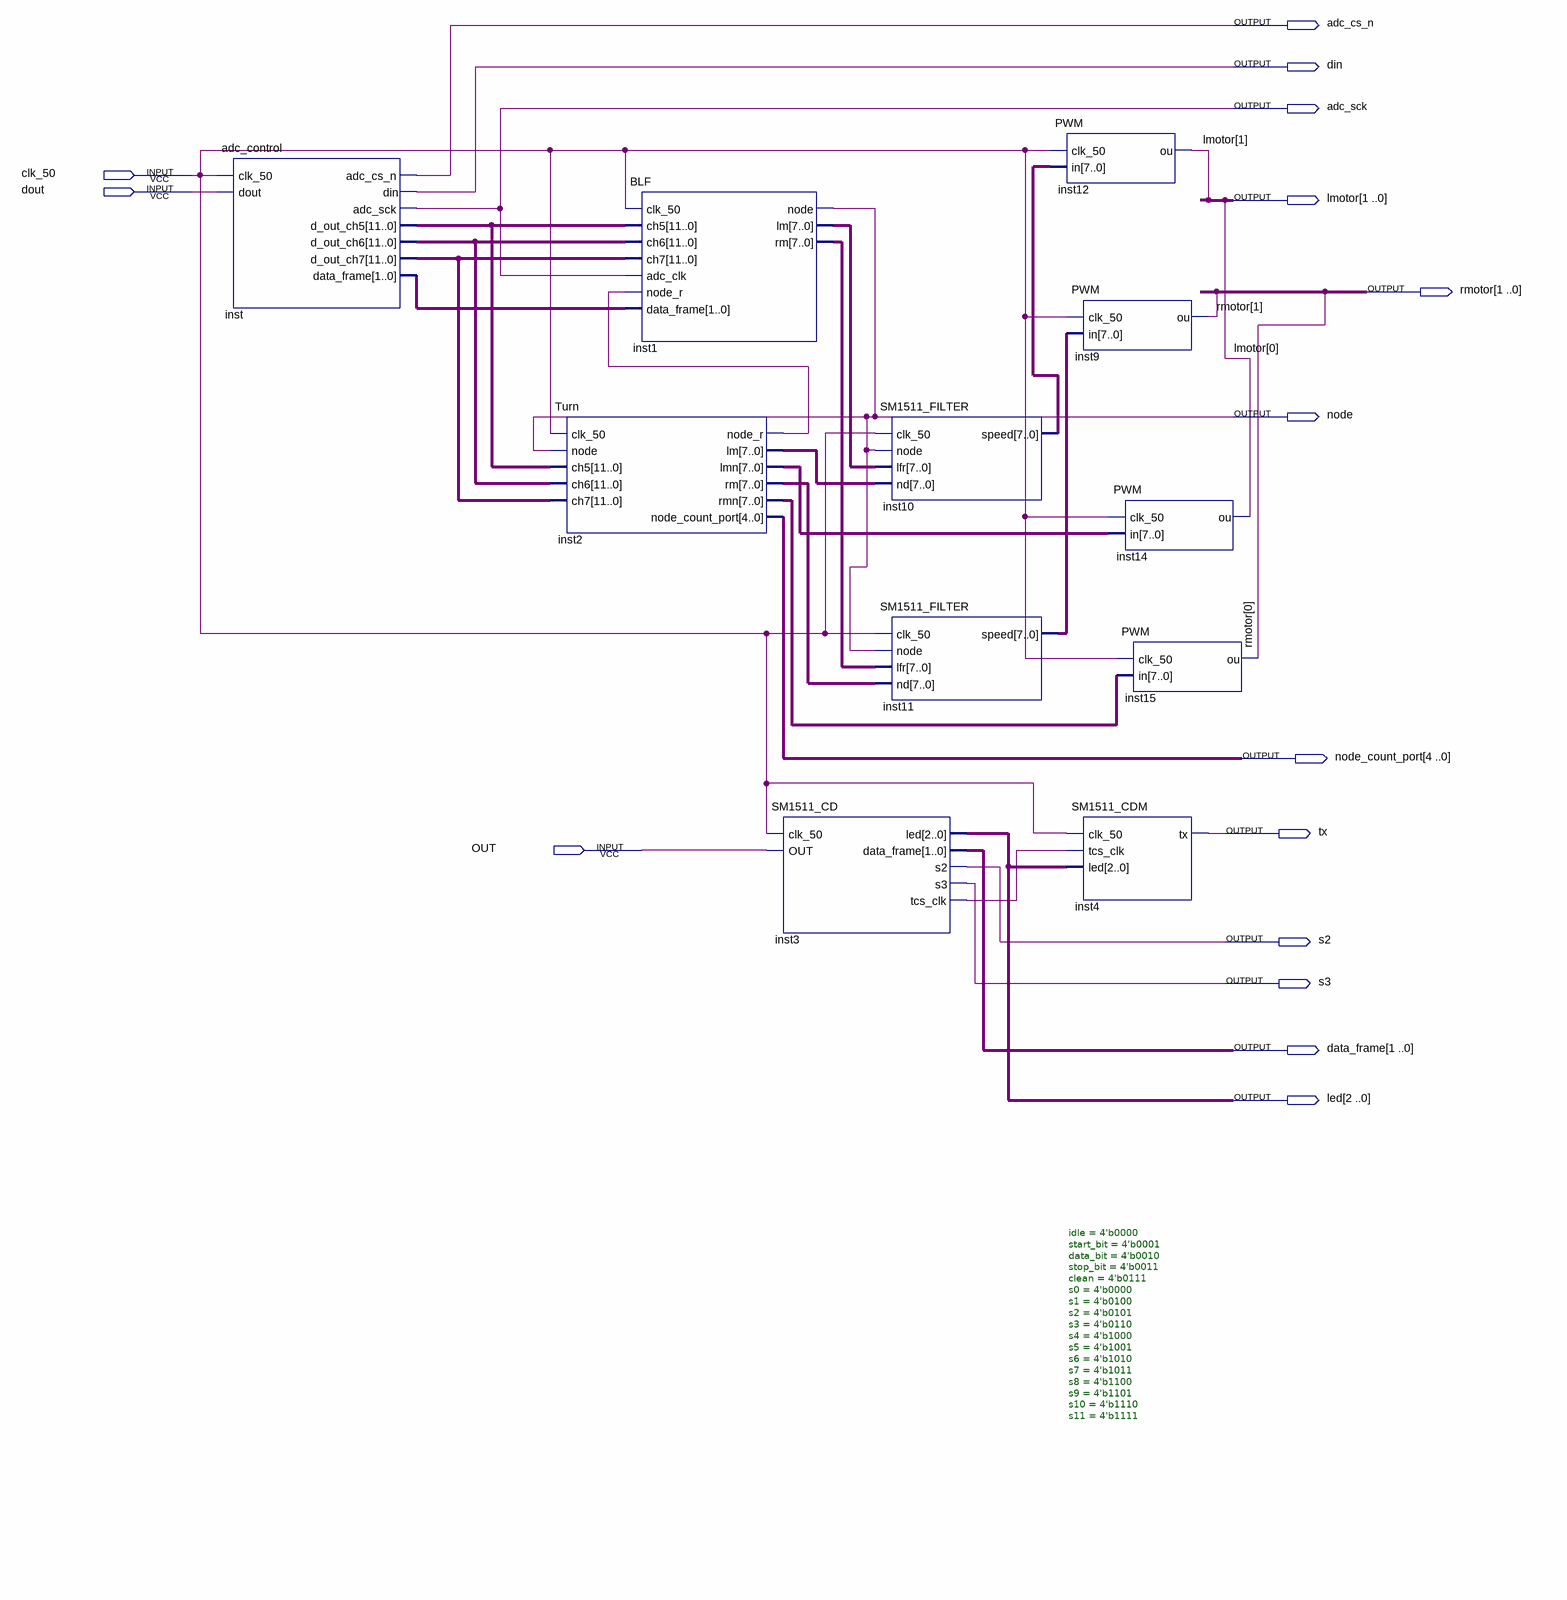
[diagram p0: schematic sheet]
// Quartus schematic BD.bdf as structural Verilog: 11 symbols, 15 pins
module BD (
  input  clk_50,
  input  dout,
  input  OUT,
  output adc_cs_n,
  output din,
  output adc_sck,
  output [1:0] lmotor,
  output [1:0] rmotor,
  output node,
  output [4:0] node_count_port,
  output tx,
  output s2,
  output s3,
  output [1:0] data_frame,
  output [2:0] led
);

  wire inst2_node_r, inst3_tcs_clk;
  wire [1:0] inst_data_frame;
  wire [7:0] inst1_lm, inst1_rm, inst2_lm, inst2_lmn, inst2_rm, inst2_rmn, inst10_speed, inst11_speed;
  wire [11:0] inst_d_out_ch5, inst_d_out_ch6, inst_d_out_ch7;

  adc_control inst (
    .clk_50(clk_50), .dout(dout), .adc_cs_n(adc_cs_n), .din(din), .adc_sck(adc_sck),
    .d_out_ch5(inst_d_out_ch5), .d_out_ch6(inst_d_out_ch6), .d_out_ch7(inst_d_out_ch7),
    .data_frame(inst_data_frame));
  Turn inst2 (
    .clk_50(clk_50), .node(node), .ch5(inst_d_out_ch5), .ch6(inst_d_out_ch6), .ch7(inst_d_out_ch7),
    .node_r(inst2_node_r), .lm(inst2_lm), .lmn(inst2_lmn), .rm(inst2_rm), .rmn(inst2_rmn),
    .node_count_port(node_count_port));
  BLF inst1 (
    .clk_50(clk_50), .ch5(inst_d_out_ch5), .ch6(inst_d_out_ch6), .ch7(inst_d_out_ch7), .adc_clk(adc_sck),
    .node_r(inst2_node_r), .data_frame(inst_data_frame), .node(node), .lm(inst1_lm), .rm(inst1_rm));
  SM1511_CD inst3 (
    .clk_50(clk_50), .OUT(OUT), .led(led), .data_frame(data_frame), .s2(s2), .s3(s3), .tcs_clk(inst3_tcs_clk));
  SM1511_FILTER inst10 (.clk_50(clk_50), .node(node), .lfr(inst1_lm), .nd(inst2_lm), .speed(inst10_speed));
  SM1511_FILTER inst11 (.clk_50(clk_50), .node(node), .lfr(inst1_rm), .nd(inst2_rm), .speed(inst11_speed));
  PWM inst12 (.clk_50(clk_50), .in(inst10_speed), .ou(lmotor[1]));
  PWM inst9 (.clk_50(clk_50), .in(inst11_speed), .ou(rmotor[1]));
  SM1511_CDM #(.idle(4'b0000), .start_bit(4'b0001), .data_bit(4'b0010), .stop_bit(4'b0011), .clean(4'b0111), .s0(4'b0000), .s1(4'b0100), .s2(4'b0101), .s3(4'b0110), .s4(4'b1000), .s5(4'b1001), .s6(4'b1010), .s7(4'b1011), .s8(4'b1100), .s9(4'b1101), .s10(4'b1110), .s11(4'b1111)) inst4 (
    .clk_50(clk_50), .tcs_clk(inst3_tcs_clk), .led(led), .tx(tx));
  PWM inst14 (.clk_50(clk_50), .in(inst2_lmn), .ou(lmotor[0]));
  PWM inst15 (.clk_50(clk_50), .in(inst2_rmn), .ou(rmotor[0]));
endmodule
